# EAGLE design 1LED (EAGLE 6.5.0)
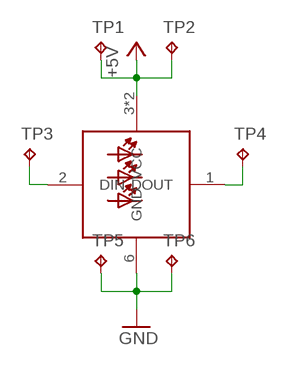
[diagram p0: schematic, sheet 1]

## Parts
TP1  TPTP15SQ  [TP15SQ]
TP2  TPTP15SQ  [TP15SQ]
TP3  TPTP15SQ  [TP15SQ]
TP4  TPTP15SQ  [TP15SQ]
TP5  TPTP15SQ  [TP15SQ]
TP6  TPTP15SQ  [TP15SQ]
U$1  RGBLED  [RGBLED]

## Nets
+5V: TP1.TP TP2.TP U$1.3(VCC) U$1.5(VCC)
GND: TP5.TP TP6.TP U$1.6(GND)
N$1: TP4.TP U$1.1(DOUT)
N$2: TP3.TP U$1.2(DIN)

## Library data of the parts
TP1-TP6 = testpad:TP: Test pad
U$1 = rgbled:RGBLED

## Board
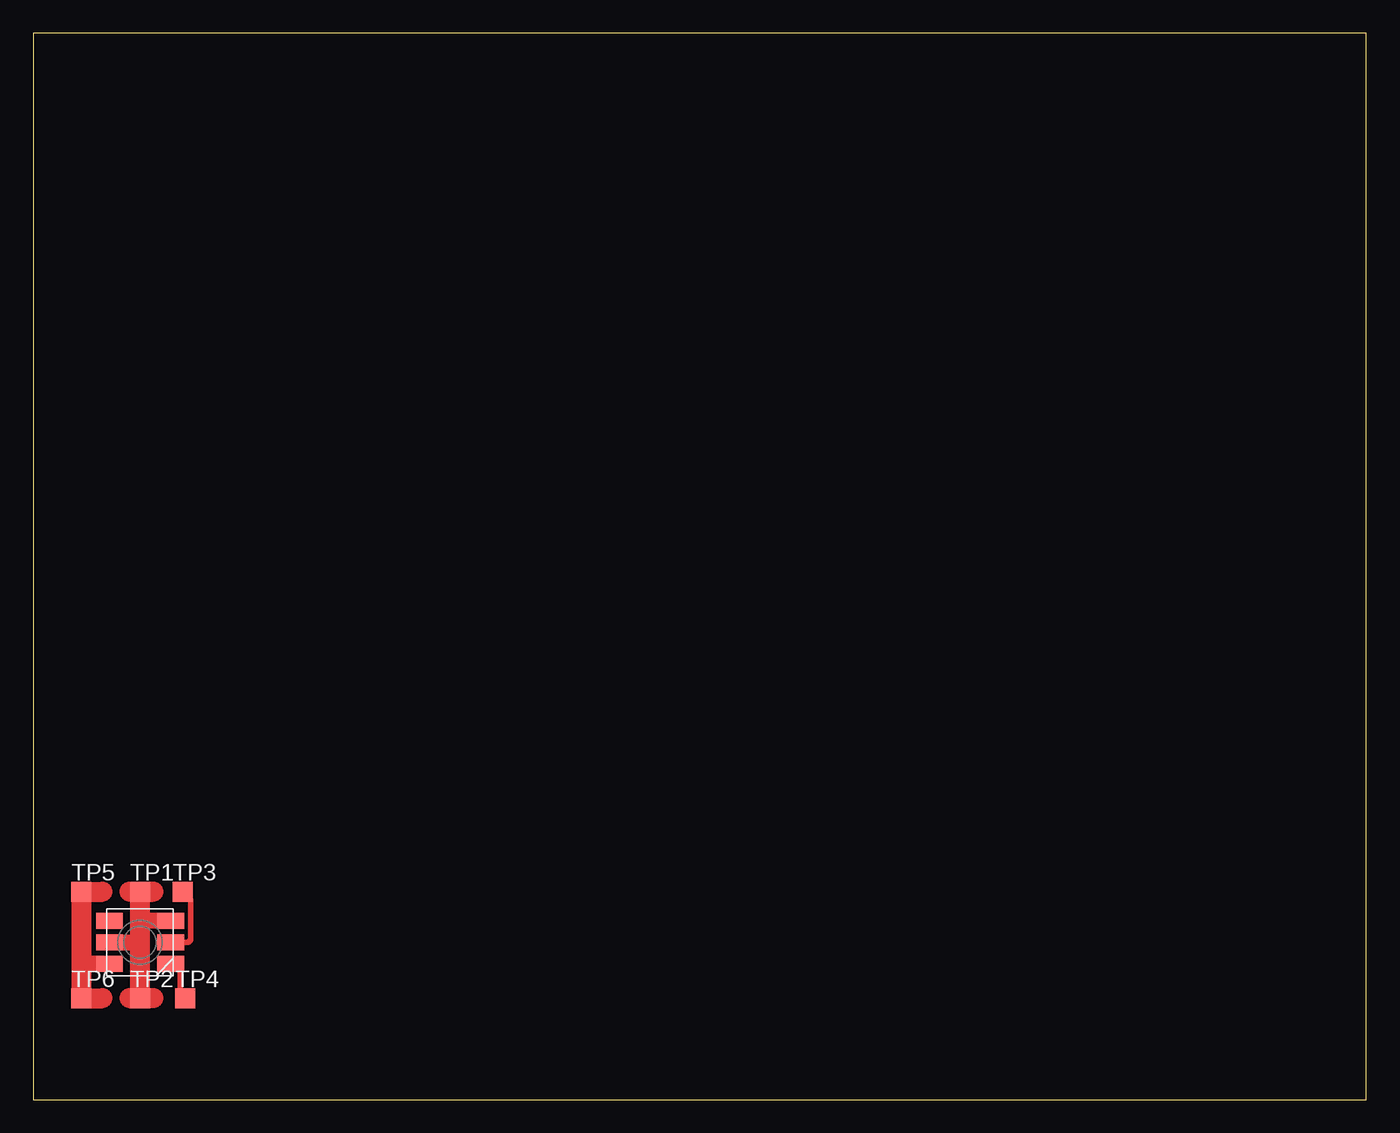
[diagram p1: board, top side]

Size 100 x 80 mm. Coordinates in mm from the lower left corner, seen from the top.
Outline: 0,0 100,0 100,80 0,80 0,0
Copper layers (1*16): Top 0.035mm / dielectric 1.6mm / Bottom 0.035mm
Design rules "default": minimum track width 0.2mm, minimum drill 0.4mm, track to track 0.2mm, track to pad 0.2mm, pad to pad 0.2mm, via to via 0.2mm, smd to smd 0mil, copper to edge 0.2mm, drill to drill 0.2mm, minimum pad ring 0.25mm, minimum via ring 0.2mm, stop-mask expansion 4mil, vias tented up to drill 0.5mm, thermal gap 10mil

### Footprints (pad centres in the part's own frame; a part is rotated, then mirrored left to right if it is on the bottom)
TP15SQ = smd 1.5 x 1.5: TP 0,0
RGBLED = smd 2 x 1.2: 1 2.3,-1.6; 2 2.3,0; 3 2.3,1.6; 4 -2.3,1.6; 5 -2.3,0; 6 -2.3,-1.6

### Placement (x,y rotation side)
TP1  8,15.6 0 top
TP2  8,7.6 0 top
TP3  11.2,15.6 0 top
TP4  11.4,7.6 0 top
TP5  3.6,15.6 0 top
TP6  3.6,7.6 0 top
U$1  8,11.8 0 top

### Tracks (layer width: path | path; a pad name or v marks a point on that pad's centre or on a via)
+5V
  Top 1.2: U$1.3 8,13.4 | U$1.5 8,11.8
  Top 1.5: TP2.TP 8,11.8 8,13.4 TP1.TP 9,15.6 7.2,15.6 | 9,7.6 TP2.TP | TP2.TP 7.2,7.6 TP2.TP
GND
  Top 1.2: U$1.6 3.8,10.2 3.6,10.4
  Top 1.5: 5.2,15.6 TP5.TP 3.6,10.4 TP6.TP 5.2,7.6
N$1
  Top 0.4: U$1.1 10.7,9.8 11,9.8 11,8 TP4.TP
N$2
  Top 0.4: U$1.2 11.6,11.8 11.8,12 11.8,15 TP3.TP